# EAGLE design RAY_shield_V4 (EAGLE 9.6.2)
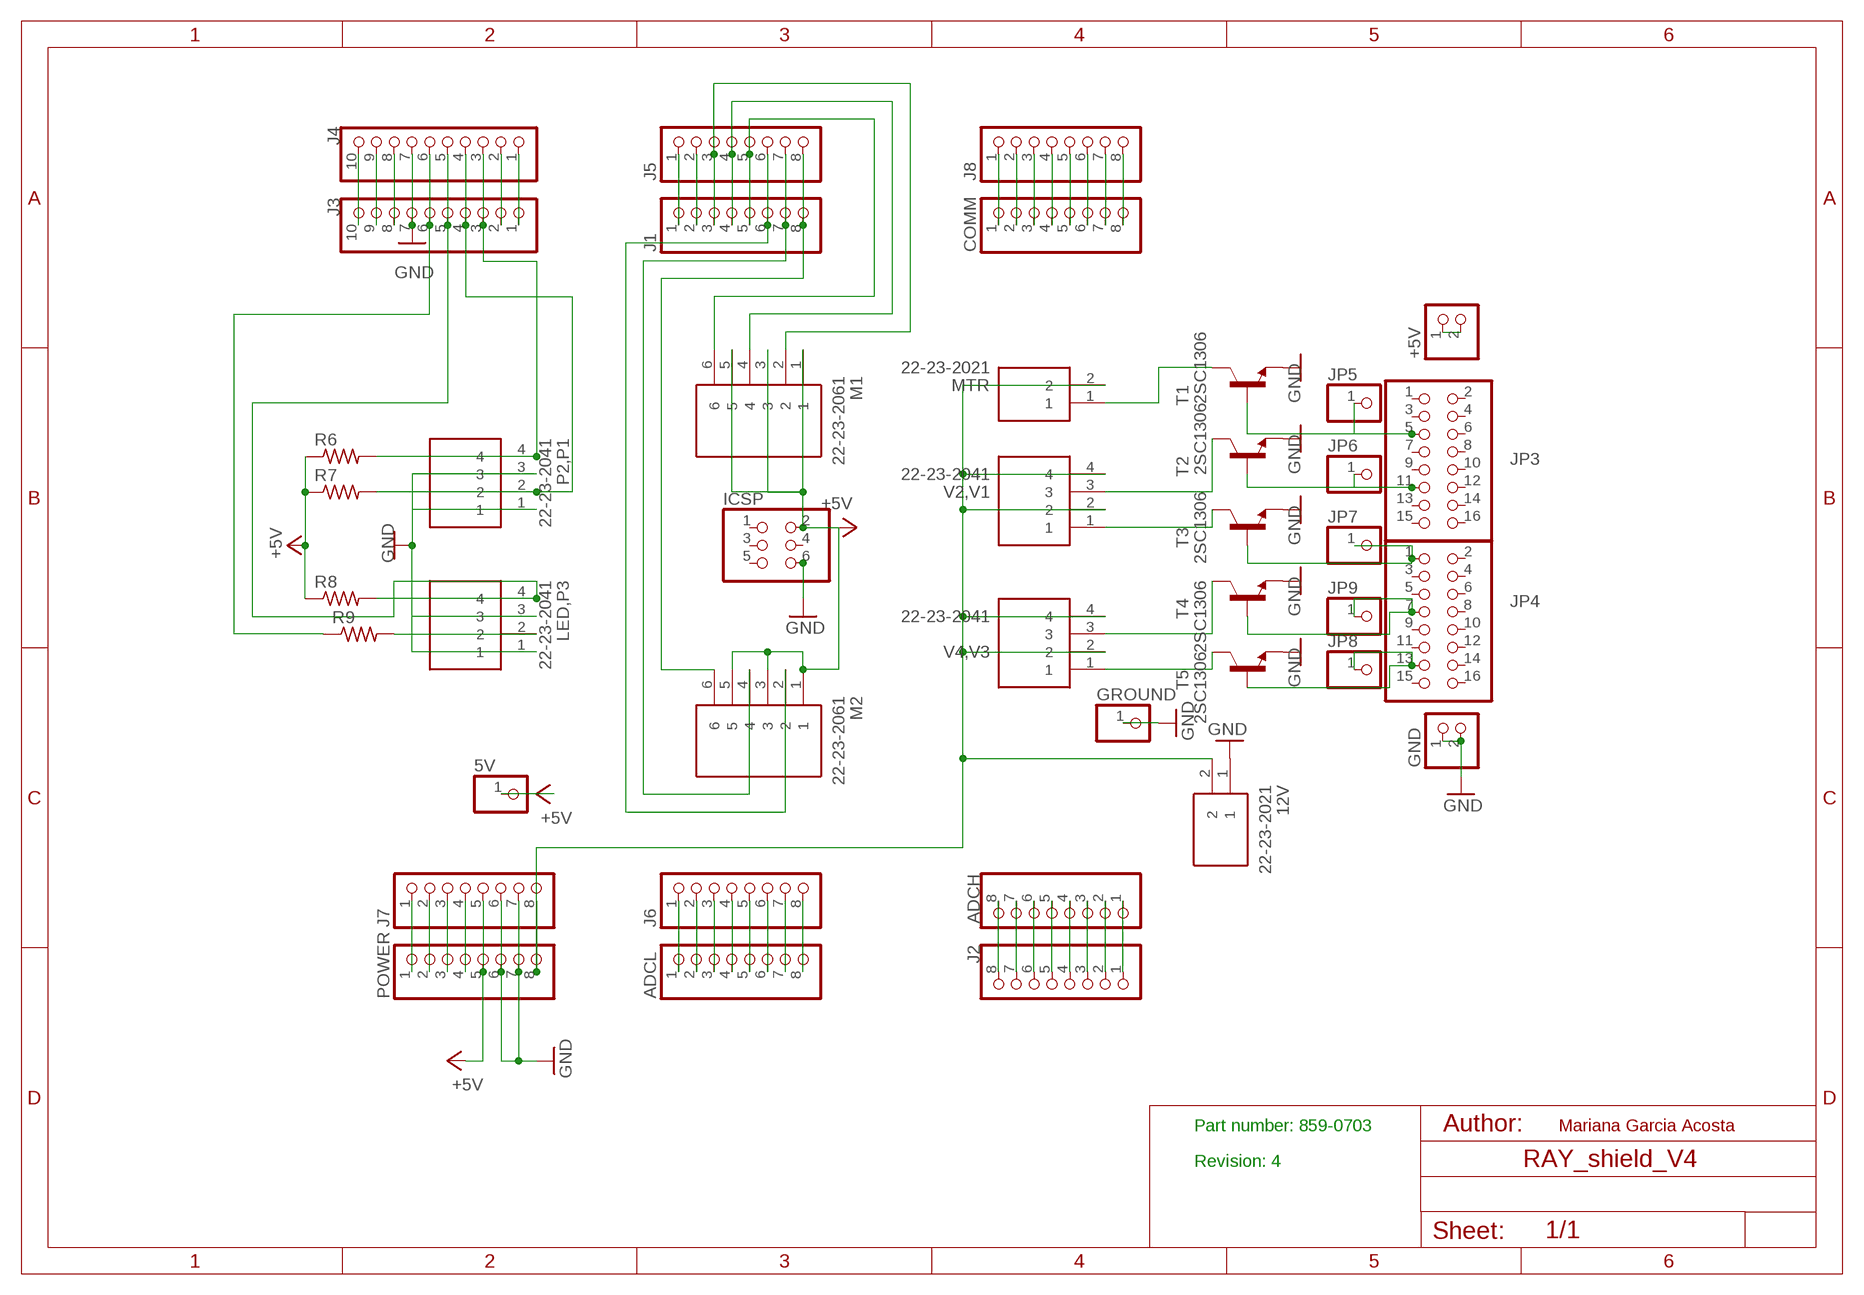
[diagram p0: schematic, sheet 1]

## Parts
5V  PINHD-1X1  [1X01]
12V  22-23-2021  [SHDR2W87P0X254_1X2_493X635X110]
+5V  PINHD-1X2  [1X02]
ADCH  PINHD-1X8TH  [1X08-TH]
ADCL  PINHD-1X8TH  [1X08-TH]
COMM  PINHD-1X8TH  [1X08-TH]
GND  PINHD-1X2  [1X02]
GROUND  PINHD-1X1  [1X01]
ICSP  PINHD-2X3  [2X03]
J1  PINHD-1X8TH  [1X08-TH]
J2  PINHD-1X8TH  [1X08-TH]
J3  PINHD-1X10TH  [1X10-TH]
J4  PINHD-1X10TH  [1X10-TH]
J5  PINHD-1X8TH  [1X08-TH]
J6  PINHD-1X8TH  [1X08-TH]
J7  PINHD-1X8TH  [1X08-TH]
J8  PINHD-1X8TH  [1X08-TH]
JP3  PINHD-2X8  [2X08]
JP4  PINHD-2X8  [2X08]
JP5  PINHD-1X1  [1X01]
JP6  PINHD-1X1  [1X01]
JP7  PINHD-1X1  [1X01]
JP8  PINHD-1X1  [1X01]
JP9  PINHD-1X1  [1X01]
LED,P3  22-23-2041  [SHDR4W87P0X254_1X4_1001X635X11]
M1  22-23-2061  [SHDR6W87P0X254_1X6_1509X635X11]
M2  22-23-2061  [SHDR6W87P0X254_1X6_1509X635X11]
MTR  22-23-2021  [SHDR2W87P0X254_1X2_493X635X110]
P2,P1  22-23-2041  [SHDR4W87P0X254_1X4_1001X635X11]
POWER  PINHD-1X8TH  [1X08-TH]
R6  R-US_0207/7  [0207/7]
R7  R-US_0207/7  [0207/7]
R8  R-US_0207/7  [0207/7]
R9  R-US_0207/7  [0207/7]
T1  2SC1306  [TO220BV]
T2  2SC1306  [TO220BV]
T3  2SC1306  [TO220BV]
T4  2SC1306  [TO220BV]
T5  2SC1306  [TO220BV]
V2,V1  22-23-2041  [SHDR4W87P0X254_1X4_1001X635X11]
V4,V3  22-23-2041  [SHDR4W87P0X254_1X4_1001X635X11]

## Nets
+5V: 5V.1 ICSP.2 J7.5 M1.1 M1.3 M1.5 M2.1 M2.3 M2.5 POWER.5 R6.1 R7.1 R8.1
+12V: 12V.2 J7.8 MTR.2 POWER.8 V2,V1.2 V2,V1.4 V4,V3.2 V4,V3.4
GND: 12V.1 GND.1 GND.2 GROUND.1 ICSP.6 J3.7 J4.7 J7.6 J7.7 LED,P3.1 LED,P3.3 P2,P1.1 P2,P1.3 POWER.6 POWER.7 T1.3(E) T2.3(E) T3.3(E) T4.3(E) T5.3(E)
N$1: +5V.1 +5V.2
N$2: J3.1 J4.1
N$3: J3.6 J4.6 R9.1
N$4: JP3.5 JP5.1 T1.1(B)
N$5: J3.4 J4.4 P2,P1.2 R7.2
N$6: J3.2 J4.2
N$7: J3.3 J4.3 P2,P1.4 R6.2
N$8: J1.1 J5.1
N$9: J1.2 J5.2
N$10: J1.3 J5.3 M1.2
N$11: J1.4 J5.4 M1.4
N$12: J1.5 J5.5 M1.6
N$13: J1.6 J5.6 M2.2
N$14: J1.7 J5.7 M2.4
N$15: J1.8 J5.8 M2.6
N$16: JP3.11 JP6.1 T2.1(B)
N$17: JP4.7 JP9.1 T4.1(B)
N$18: ADCL.1 J6.1
N$19: ADCL.2 J6.2
N$20: ADCL.3 J6.3
N$21: ADCL.4 J6.4
N$22: ADCL.5 J6.5
N$23: ADCL.6 J6.6
N$24: JP4.1 JP7.1 T3.1(B)
N$26: JP4.13 JP8.1 T5.1(B)
N$29: MTR.1 T1.2(C)
N$30: T2.2(C) V2,V1.3
N$31: T3.2(C) V2,V1.1
N$32: T4.2(C) V4,V3.3
N$33: T5.2(C) V4,V3.1
N$34: LED,P3.2 R9.2
N$38: ADCL.7 J6.7
N$63: ADCL.8 J6.8
N$64: ADCH.1 J2.1
N$88: ADCH.2 J2.2
N$89: ADCH.3 J2.3
N$116: ADCH.4 J2.4
N$121: ADCH.5 J2.5
N$124: ADCH.6 J2.6
N$125: J7.4 POWER.4
N$126: J3.9 J4.9
N$127: ADCH.7 J2.7
N$128: ADCH.8 J2.8
N$129: COMM.1 J8.1
N$130: COMM.2 J8.2
N$133: COMM.3 J8.3
N$134: COMM.4 J8.4
N$136: COMM.5 J8.5
N$137: COMM.6 J8.6
N$138: COMM.7 J8.7
N$139: COMM.8 J8.8
N$140: J3.5 J4.5 LED,P3.4 R8.2
N$219: J7.2 POWER.2
N$220: J7.1 POWER.1
N$222: J3.8 J4.8
N$223: J3.10 J4.10
RESET: J7.3 POWER.3
Unconnected: ICSP.1 ICSP.3 ICSP.4 ICSP.5 JP3.1 JP3.2 JP3.3 JP3.4 JP3.6 JP3.7 JP3.8 JP3.9 JP3.10 JP3.12 JP3.13 JP3.14 JP3.15 JP3.16 JP4.2 JP4.3 JP4.4 JP4.5 JP4.6 JP4.8 JP4.9 JP4.10 JP4.11 JP4.12 JP4.14 JP4.15 JP4.16

## Notes on the sheet
- Part number: 859-0703 | Mariana Garcia Acosta
- Revision: 4

## Library data of the parts
5V GROUND JP5-JP9 = pinhead:PINHD-1X1: PIN HEADER
12V MTR = SamacSys_Parts:22-23-2021: Headers & Wire Housings VERT PCB HDR 2P TIN FRICTION LOCK Source: Datasheet; DESCRIPTION: Headers & Wire Housings VERT PCB HDR 2P TIN FRICTION LOCK; HEIGHT: 11.05mm; MANUFACTURER_NAME: Molex; MANUFACTURER_PART_NUMBER: 22-23-2021; MOUSER_PART_NUMBER: 538-22-23-2021; MOUSER_PRICE-STOCK: https://www.mouser.co.uk/ProductDetail/Molex/22-23-2021?qs=ILqg114nvd4YKlRlbo3yMg%3D%3D
+5V GND = pinhead:PINHD-1X2: PIN HEADER
ADCH ADCL COMM J1 J2 J5-J8 POWER = Smartprj:PINHD-1X8: PIN HEADER
ICSP = Smartprj:PINHD-2X3: PIN HEADER
J3 J4 = Smartprj:PINHD-1X10: PIN HEADER
JP3 JP4 = pinhead:PINHD-2X8: PIN HEADER
LED,P3 P2,P1 V2,V1 V4,V3 = SamacSys_Parts:22-23-2041: 2.54mm,header,KK,vert,Sn,frictn lock,4w Molex KK 254 Series, Series Number 6373, 2.54mm Pitch 4 Way 1 Row Straight PCB Header, Through Hole, Solder Termination Source: Datasheet <http://www.molex.com/pdm_docs/sd/022232041_sd.pdf>; DESCRIPTION: 2.54mm,header,KK,vert,Sn,frictn lock,4w Molex KK 254 Series, Series Number 6373, 2.54mm Pitch 4 Way 1 Row Straight PCB Header, Through Hole, Solder Termination; HEIGHT: 11.05mm; MANUFACTURER_NAME: Molex; MANUFACTURER_PART_NUMBER: 22-23-2041; MOUSER_PART_NUMBER: 538-22-23-2041; MOUSER_PRICE-STOCK: https://www.mouser.co.uk/ProductDetail/Molex/22-23-2041?qs=ILqg114nvd5W6e%252BaZws1Xg%3D%3D
M1 M2 = SamacSys_Parts:22-23-2061: 2.54mm,header,KK,vert,Sn,frictn lock,6w Molex KK 254 Series, Series Number 6373, 2.54mm Pitch 6 Way 1 Row Straight PCB Header, Through Hole, Solder Termination Source: Datasheet <http://www.molex.com/pdm_docs/sd/022232061_sd.pdf>; DESCRIPTION: 2.54mm,header,KK,vert,Sn,frictn lock,6w Molex KK 254 Series, Series Number 6373, 2.54mm Pitch 6 Way 1 Row Straight PCB Header, Through Hole, Solder Termination; HEIGHT: 11.05mm; MANUFACTURER_NAME: Molex; MANUFACTURER_PART_NUMBER: 22-23-2061; MOUSER_PART_NUMBER: 538-22-23-2061; MOUSER_PRICE-STOCK: https://www.mouser.co.uk/ProductDetail/Molex/22-23-2061?qs=ILqg114nvd6YkpLBwrcQsQ%3D%3D
R6-R9 = rcl:R-US_: RESISTOR, American symbol; SPICEPREFIX: R
T1-T5 = transistor:2SC1306: NPN Transistor Final RF Power Outupt Source: 2sc1306.pdf

## Board
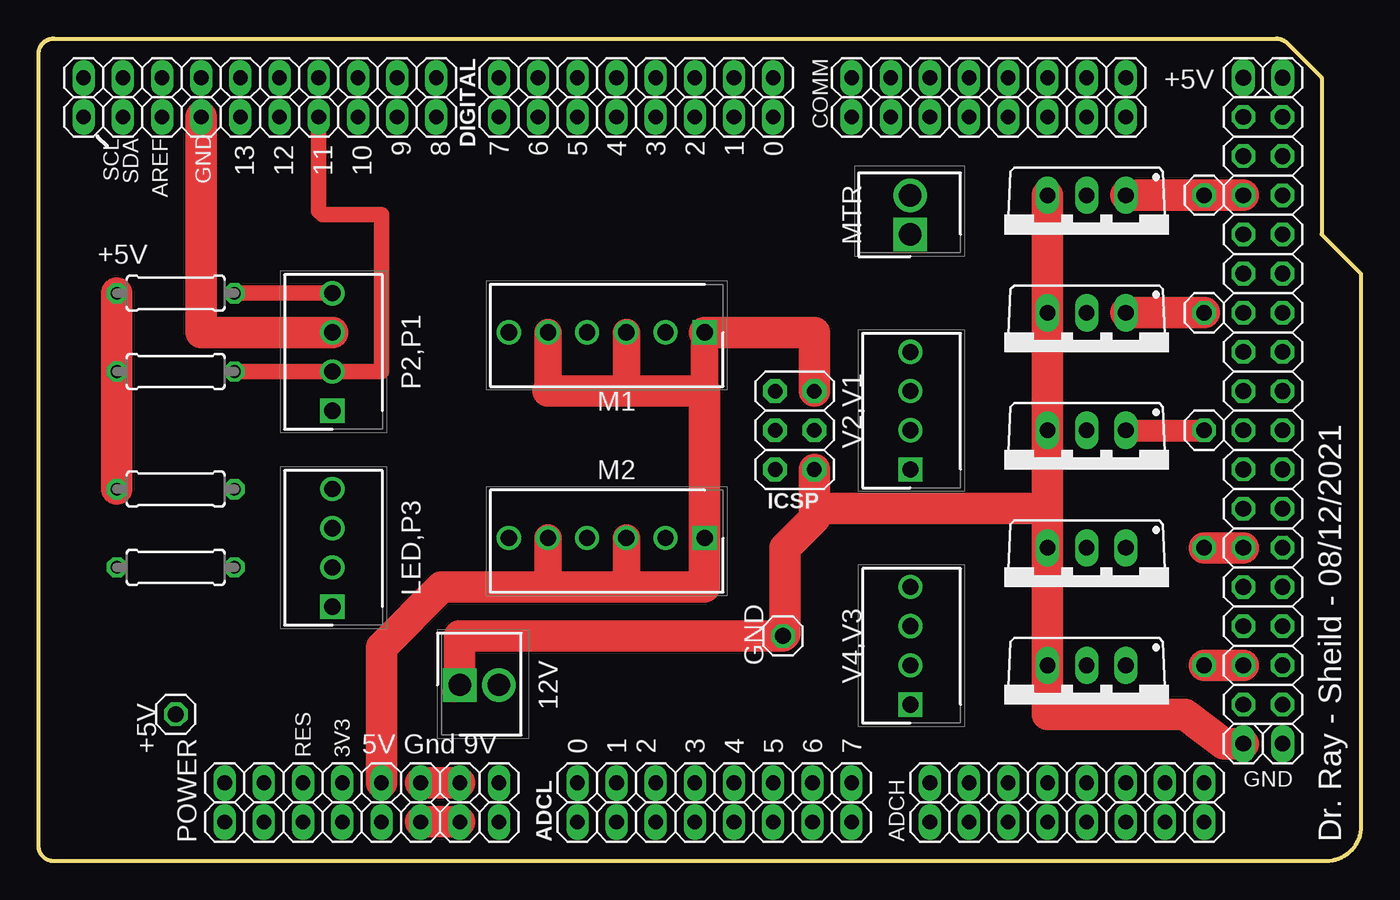
[diagram p1: board, top side]
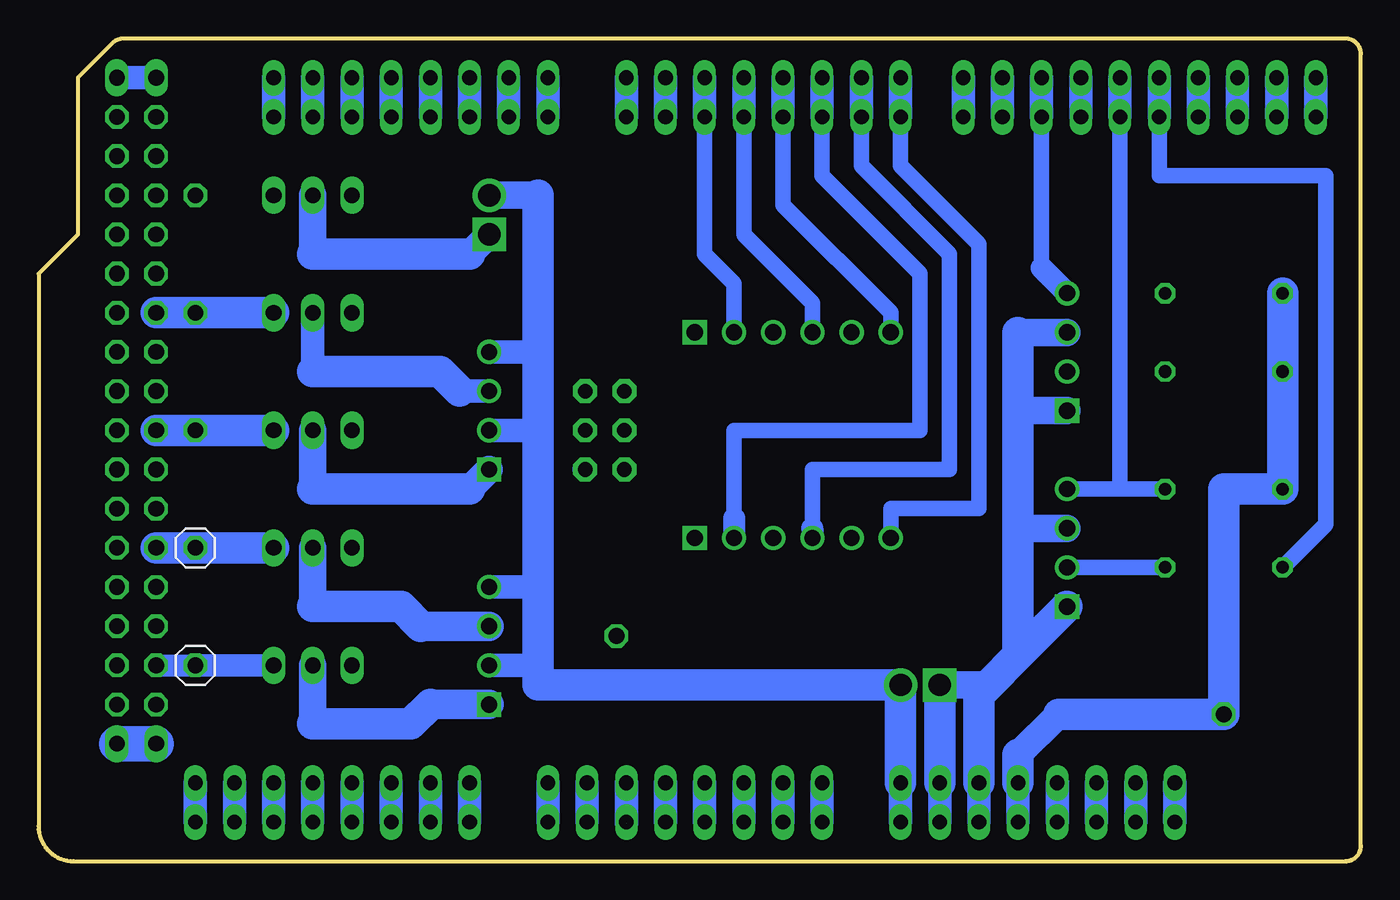
[diagram p2: board, bottom side, seen from below]

Size 85.72 x 53.34 mm. Coordinates in mm from the lower left corner, seen from the top.
Outline: 83.19,40.64 85.72,38.1 85.72,2.27 arc-90 83.45,0 1,0 arc-90 0,1 0,52.34 arc-90 1,53.34 80.23,53.34 arc-45 80.94,53.05 83.19,50.8 83.19,40.64
Copper layers (1*16): Top 0.035mm / dielectric 1.5mm / Bottom 0.035mm
Design rules "default *": minimum track width 10mil, minimum drill 24mil, track to track 8mil, track to pad 8mil, pad to pad 8mil, via to via 8mil, smd to smd 8mil, copper to edge 40mil, drill to drill 8mil, minimum pad ring 10mil, minimum via ring 8mil, stop-mask expansion 2mil, vias tented up to drill 0mil, thermal gap 10mil

### Footprints (pad centres in the part's own frame; a part is rotated, then mirrored left to right if it is on the bottom)
1X01 = drill 1.016 octagon: 1 0,0
SHDR2W87P0X254_1X2_493X635X110 = drill 1.45 pad 2.175 square: 1 0,0 | drill 1.45 pad 2.175: 2 2.54,0
1X02 = drill 1.016 long: 1 -1.27,0; 2 1.27,0
1X08-TH = drill 0.95 pad 1.422 long: 1 -8.89,0; 2 -6.35,0; 3 -3.81,0; 4 -1.27,0; 5 1.27,0; 6 3.81,0; 7 6.35,0; 8 8.89,0
2X03 = drill 0.95 pad 1.55 octagon: 1 -2.54,-1.27; 2 -2.54,1.27; 3 0,-1.27; 4 0,1.27; 5 2.54,-1.27; 6 2.54,1.27
1X10-TH = drill 0.95 pad 1.422 long: 1 -11.43,0; 2 -8.89,0; 3 -6.35,0; 4 -3.81,0; 5 -1.27,0; 6 1.27,0; 7 3.81,0; 8 6.35,0; 9 8.89,0; 10 11.43,0
2X08 = drill 1.016 octagon: 1 -8.89,-1.27; 2 -8.89,1.27; 3 -6.35,-1.27; 4 -6.35,1.27; 5 -3.81,-1.27; 6 -3.81,1.27; 7 -1.27,-1.27; 8 -1.27,1.27; 9 1.27,-1.27; 10 1.27,1.27; 11 3.81,-1.27; 12 3.81,1.27; 13 6.35,-1.27; 14 6.35,1.27; 15 8.89,-1.27; 16 8.89,1.27
SHDR4W87P0X254_1X4_1001X635X11 = drill 1.05 pad 1.575 square: 1 0,0 | drill 1.05 pad 1.575: 2 2.54,0; 3 5.08,0; 4 7.62,0
SHDR6W87P0X254_1X6_1509X635X11 = drill 1.05 pad 1.575 square: 1 0,0 | drill 1.05 pad 1.575: 2 2.54,0; 3 5.08,0; 4 7.62,0; 5 10.16,0; 6 12.7,0
0207/7 = drill 0.813 octagon: 1 -3.81,0; 2 3.81,0
TO220BV = drill 1.016 long: 1 -2.54,-2.54; 2 0,-2.54; 3 2.54,-2.54

### Placement (x,y rotation side)
5V  8.89,9.53 0 top
12V  27.3,11.43 0 top
+5V  79.38,50.8 0 top
ADCH  66.67,2.54 0 top
ADCL  43.81,2.54 0 top
COMM  61.59,50.8 0 top
GND  79.38,7.62 0 top
GROUND  48.26,14.61 0 top
ICSP  49.02,27.94 270 top
J1  38.73,50.8 180 top
J2  66.67,5.08 0 top
J3  14.35,50.8 180 top
J4  14.35,48.26 180 top
J5  38.73,48.26 180 top
J6  43.81,5.08 0 top
J7  20.95,2.54 0 top
J8  61.59,48.26 0 top
JP3  79.38,39.37 270 top
JP4  79.38,19.05 270 top
JP5  75.56,43.18 0 top
JP6  75.56,35.56 0 top
JP7  75.56,27.94 0 top
JP8  75.56,12.7 0 bottom
JP9  75.56,20.32 180 bottom
LED,P3  19.05,16.51 90 top
M1  43.18,34.29 180 top
M2  43.18,20.95 180 top
MTR  56.52,40.64 90 top
P2,P1  19.05,29.21 90 top
POWER  20.95,5.08 0 top
R6  8.89,36.83 0 top
R7  8.89,31.75 0 top
R8  8.89,24.13 0 top
R9  8.89,19.05 0 top
T1  67.94,40.64 180 top
T2  67.94,33.02 180 top
T3  67.94,25.4 180 top
T4  67.94,17.78 180 top
T5  67.94,10.16 180 top
V2,V1  56.52,25.4 90 top
V4,V3  56.52,10.16 90 top

### Tracks (layer width: path | path; a pad name or v marks a point on that pad's centre or on a via)
+5V
  Top 1.422: ICSP.2 50.29,33.02
  Top 1.778: 38.1,17.78 M2.3 | M2.5 33.02,17.78 | M1.5 33.02,30.48 | M1.3 38.1,30.48 | M1.1 43.18,30.48
  Top 2.032: POWER.5 22.23,13.88 26.12,17.78 33.02,17.78 38.1,17.78 43.18,17.78 M2.1 43.18,30.48 38.1,30.48 33.02,30.48 | R6.1 R8.1 | M1.1 50.29,34.29 ICSP.2
  Bottom 1.524: J7.5 POWER.5
  Bottom 1.778: 22.23,6.89 19.59,9.53
  Bottom 2.032: POWER.5 22.23,6.89 22.2,6.93 | 19.59,9.53 5V.1 8.89,24.13 R8.1 R7.1 R6.1
+12V
  Bottom 1.524: V2,V1.4 53.34,33.02 | V2,V1.2 53.34,27.94 | V4,V3.4 53.34,17.78 | V4,V3.2 53.34,12.7 | J7.8 POWER.8
  Bottom 1.778: 53.34,43.18 MTR.2
  Bottom 2.032: 12V.2 POWER.8 | 53.34,11.43 53.34,12.7 53.34,17.78 53.34,27.94 53.34,33.02 53.34,43.18 | 53.34,11.43 12V.2 | 53.34,11.43 12V.2
GND
  Top 1.422: 27.52,11.64 12V.1 26.88,11.01 | 48.39,14.73 GROUND.1
  Top 1.778: ICSP.6 50.29,22.86
  Top 2.032: P2,P1.3 10.54,34.29 J4.7 | J7.7 J7.6 | POWER.6 POWER.7 | 65.41,22.86 T3.3 T2.3 T1.3 | 65.41,22.86 T4.3 T5.3 65.41,9.53 74.3,9.53 76.83,7.62 GND.1 | 65.41,22.86 50.29,22.86 | 12V.1 27.3,14.61 GROUND.1 | ICSP.6 50.29,22.23 48.39,20.32 48.39,14.73
  Bottom 1.422: ICSP.6 50.42,25.4
  Bottom 1.524: POWER.7 J7.7 | J3.7 J4.7 | J7.6 POWER.6
  Bottom 1.778: 22.23,34.29 P2,P1.3 | 22.23,21.59 LED,P3.3 | 22.23,29.21 P2,P1.1 | 24.13,11.43 12V.1
  Bottom 2.032: POWER.6 24.77,10.79 24.13,11.43 22.23,13.34 | 22.23,13.34 LED,P3.1 | 22.23,13.34 22.23,21.59 22.23,29.21 22.23,34.29 | 12V.1 POWER.7
  Bottom 2.286: GND.1 GND.2
N$1
  Bottom 1.524: +5V.1 +5V.2
N$2
  Bottom 1.524: J3.1 J4.1
N$3
  Bottom 0.254: J4.6 13.25,48.1
  Bottom 1.016: J4.6 13.08,44.45 2.29,44.45 2.29,21.84 R9.1
  Bottom 1.524: J3.6 J4.6
N$4
  Top 2.032: JP5.1 T1.1 JP3.5 JP5.1
N$5
  Top 1.016: J4.4 18.16,42.16 18.41,41.91 22.23,41.91 22.23,31.75 P2,P1.2 R7.2
  Bottom 1.524: J3.4 J4.4
N$6
  Bottom 1.524: J3.2 J4.2
N$7
  Top 1.016: R6.2 P2,P1.4
  Bottom 1.016: J4.3 20.7,38.48
  Bottom 1.422: 20.7,38.48 P2,P1.4
  Bottom 1.524: J3.3 J4.3
N$8
  Bottom 1.524: J1.1 J5.1
N$9
  Bottom 1.524: J1.2 J5.2
N$10
  Bottom 1.016: J5.3 42.55,39.37 40.64,37.47 M1.2
  Bottom 1.524: J1.3 J5.3
N$11
  Bottom 1.016: J5.4 40.01,40.64 35.56,36.2 M1.4
  Bottom 1.524: J1.4 J5.4
N$12
  Bottom 1.016: J5.5 37.47,42.55 30.48,35.56 M1.6
  Bottom 1.524: J1.5 J5.5
N$13
  Bottom 1.016: J5.6 34.92,44.45 28.58,38.1 28.58,27.94 40.64,27.94 M2.2
  Bottom 1.422: 40.64,22.23 M2.2
  Bottom 1.524: J1.6 J5.6
N$14
  Bottom 1.016: J5.7 32.38,45.09 26.67,39.37 26.67,25.4 35.56,25.4 M2.4
  Bottom 1.422: 35.56,21.59 M2.4
  Bottom 1.524: J1.7 J5.7
N$15
  Bottom 1.016: J5.8 29.84,45.09 24.77,40.01 24.77,22.86 30.48,22.86 M2.6
  Bottom 1.524: J1.8 J5.8
N$16
  Top 2.032: JP6.1 T2.1
  Bottom 2.032: T2.1 JP6.1 JP3.11
N$17
  Top 2.032: JP4.7 JP9.1
  Bottom 1.422: T4.1 JP9.1
  Bottom 2.032: T4.1 JP4.7
N$18
  Bottom 1.524: ADCL.1 J6.1
N$19
  Bottom 1.524: J6.2 ADCL.2
N$20
  Bottom 1.524: J6.3 ADCL.3
N$21
  Bottom 1.524: J6.4 ADCL.4
N$22
  Bottom 1.524: J6.5 ADCL.5
N$23  (1 unrouted)
  Top 0.61: ADCL.6 47.53,2.63 47.62,2.47
  Bottom 1.524: J6.6 47.62,2.47
N$24
  Top 1.422: T3.1 JP7.1
  Bottom 2.032: JP7.1 JP4.1 T3.1
N$26
  Top 2.032: JP8.1 JP4.13
  Bottom 1.422: JP8.1 T5.1 JP4.13
N$29
  Bottom 1.778: T1.2 67.94,39.37 | 57.78,39.37 MTR.1
  Bottom 2.032: 67.94,39.37 57.78,39.37
N$30
  Bottom 1.524: T2.2 67.94,31.75 | 58.42,30.48 V2,V1.3
  Bottom 2.032: 67.94,31.75 59.69,31.75 58.42,30.48
N$31
  Bottom 1.778: T3.2 67.94,24.13 | 57.78,24.13 V2,V1.1
  Bottom 2.032: 67.94,24.13 57.78,24.13
N$32
  Bottom 1.778: T4.2 67.94,16.51
  Bottom 1.905: V4,V3.3 60.96,15.24
  Bottom 2.032: 67.94,16.51 62.23,16.51 60.96,15.24
N$33
  Bottom 1.778: T5.2 67.94,8.89
  Bottom 1.905: 60.33,10.16 V4,V3.1
  Bottom 2.032: 67.94,8.89 61.59,8.89 60.33,10.16
N$34
  Bottom 1.016: LED,P3.2 R9.2
N$38
  Bottom 1.524: J6.7 ADCL.7
N$63
  Bottom 1.524: J6.8 ADCL.8
N$64
  Bottom 1.524: J2.1 ADCH.1
N$88
  Bottom 1.524: J2.2 ADCH.2
N$89
  Bottom 1.524: J2.3 ADCH.3
N$116
  Bottom 1.524: J2.4 ADCH.4
N$121
  Bottom 1.524: J2.5 ADCH.5
N$124
  Bottom 1.524: J2.6 ADCH.6
N$125
  Bottom 1.524: POWER.4 J7.4
N$126
  Bottom 1.524: J3.9 J4.9
N$127
  Bottom 1.524: J2.7 ADCH.7
N$128
  Bottom 1.524: J2.8 ADCH.8
N$129
  Bottom 1.524: COMM.1 J8.1
N$130
  Bottom 1.524: COMM.2 J8.2
N$133
  Bottom 1.524: COMM.3 J8.3
N$134
  Bottom 1.524: COMM.4 J8.4
N$136
  Bottom 1.524: COMM.5 J8.5
N$137
  Bottom 1.524: COMM.6 J8.6
N$138
  Bottom 1.524: COMM.7 J8.7
N$139
  Bottom 1.524: COMM.8 J8.8
N$140
  Bottom 0.254: J4.5 15.79,48.1
  Bottom 1.016: J4.5 15.62,24.13 LED,P3.4 R8.2
  Bottom 1.524: J3.5 J4.5
N$219
  Bottom 1.524: POWER.2 J7.2
N$220
  Bottom 1.524: POWER.1 J7.1
N$222
  Bottom 1.524: J3.8 J4.8
N$223
  Bottom 1.524: J4.10 J3.10
RESET
  Bottom 1.524: POWER.3 J7.3

### Text on the board
tPlace: 9 | 8 | 7 | 6 | 5 | 4 | 3 | 2 | 1 | 0 | 13 | 12 | 11 | 10 | +5V | GND | +5V | 0 | 1 | 2 | 3 | 4 | 5 | 6 | 7 | Dr. Ray - Sheild - 08/12/2021
tNames: DIGITAL | SCL | SDA | AREF | GND | RES | 3V3 | 5V Gnd 9V